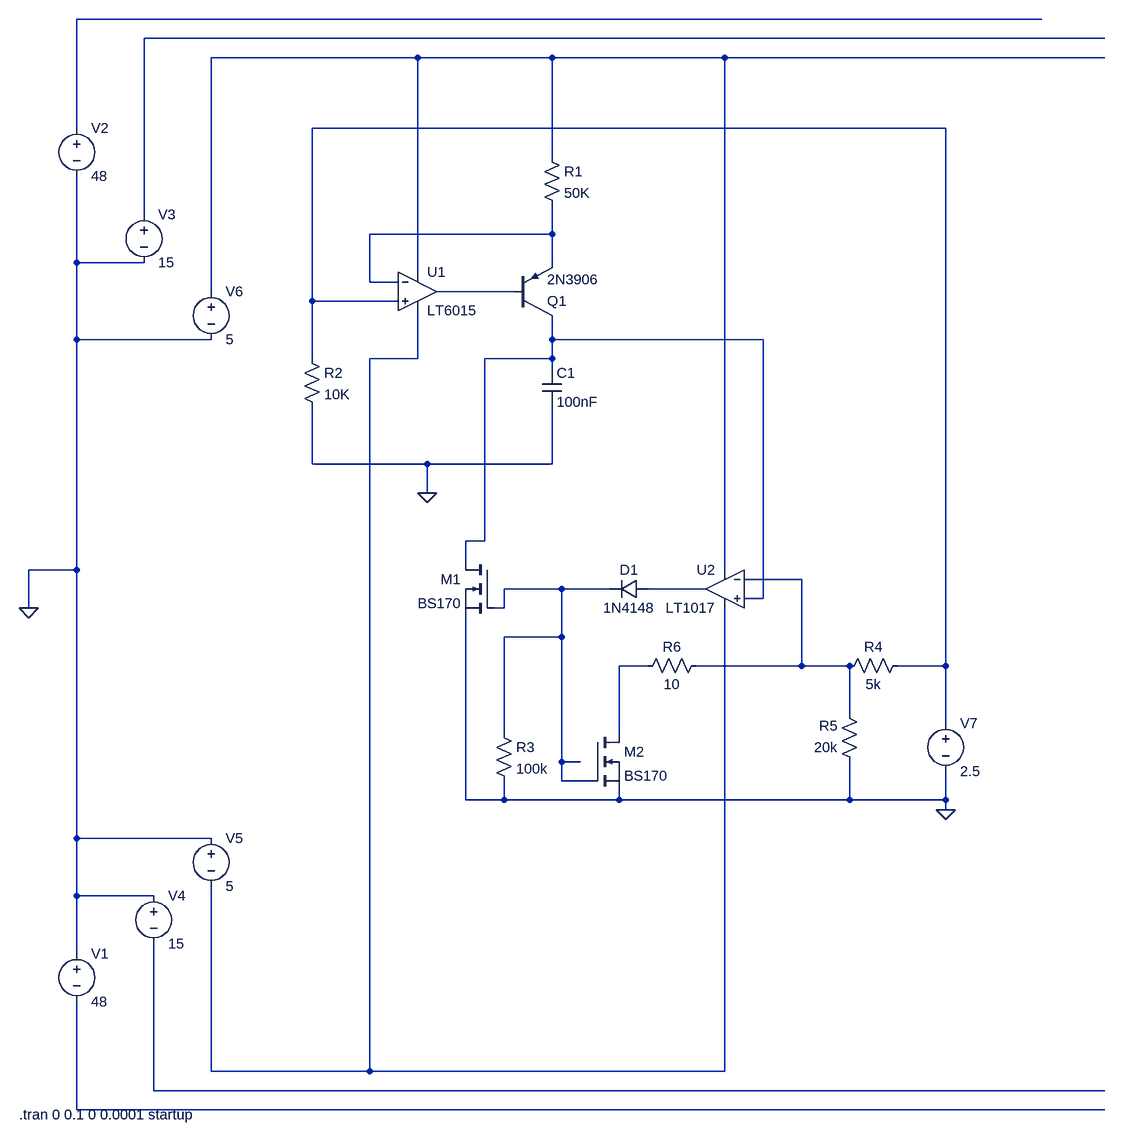
[diagram p0: schematic SWEEPGEN-2.asc]
SWEEPGEN-2.asc, the LTspice schematic file:
Version 4.1
SHEET 1 5972 680
WIRE 5328 -1472 48 -1472
WIRE 5968 -1440 160 -1440
WIRE 3376 -1408 272 -1408
WIRE 3600 -1408 3376 -1408
WIRE 3888 -1408 3600 -1408
WIRE 5968 -1408 3888 -1408
WIRE 48 -1280 48 -1472
WIRE 4256 -1280 3200 -1280
WIRE 3600 -1232 3600 -1408
WIRE 160 -1136 160 -1440
WIRE 3600 -1104 3600 -1152
WIRE 3600 -1104 3296 -1104
WIRE 48 -1056 48 -1200
WIRE 160 -1056 48 -1056
WIRE 3600 -1056 3600 -1104
WIRE 3376 -1040 3376 -1408
WIRE 3296 -1024 3296 -1104
WIRE 3344 -1024 3296 -1024
WIRE 272 -1008 272 -1408
WIRE 3536 -1008 3408 -1008
WIRE 3200 -992 3200 -1280
WIRE 3344 -992 3200 -992
WIRE 48 -928 48 -1056
WIRE 272 -928 48 -928
WIRE 3600 -928 3600 -960
WIRE 3952 -928 3600 -928
WIRE 3200 -896 3200 -992
WIRE 3376 -896 3376 -976
WIRE 3376 -896 3296 -896
WIRE 3600 -896 3600 -928
WIRE 3600 -896 3488 -896
WIRE 3600 -880 3600 -896
WIRE 3200 -720 3200 -816
WIRE 3392 -720 3200 -720
WIRE 3600 -720 3600 -816
WIRE 3600 -720 3392 -720
WIRE 3392 -672 3392 -720
WIRE 3488 -592 3488 -896
WIRE 3488 -592 3456 -592
WIRE 3456 -560 3456 -592
WIRE 48 -544 48 -928
WIRE 48 -544 -32 -544
WIRE 3888 -544 3888 -1408
WIRE 4016 -528 3920 -528
WIRE 3616 -512 3520 -512
WIRE 3696 -512 3616 -512
WIRE 3856 -512 3760 -512
WIRE 3952 -496 3952 -928
WIRE 3952 -496 3920 -496
WIRE -32 -480 -32 -544
WIRE 3520 -480 3520 -512
WIRE 3520 -480 3504 -480
WIRE 3616 -432 3616 -512
WIRE 3616 -432 3520 -432
WIRE 3760 -384 3712 -384
WIRE 4016 -384 4016 -528
WIRE 4016 -384 3840 -384
WIRE 4096 -384 4016 -384
WIRE 4256 -384 4256 -1280
WIRE 4256 -384 4176 -384
WIRE 4096 -304 4096 -384
WIRE 4256 -288 4256 -384
WIRE 3520 -272 3520 -432
WIRE 3712 -272 3712 -384
WIRE 3616 -224 3616 -432
WIRE 3648 -224 3616 -224
WIRE 3616 -192 3616 -224
WIRE 3664 -192 3616 -192
WIRE 3456 -160 3456 -464
WIRE 3520 -160 3520 -192
WIRE 3520 -160 3456 -160
WIRE 3712 -160 3712 -176
WIRE 3712 -160 3520 -160
WIRE 4096 -160 4096 -224
WIRE 4096 -160 3712 -160
WIRE 4256 -160 4256 -208
WIRE 4256 -160 4096 -160
WIRE 4256 -144 4256 -160
WIRE 48 -96 48 -544
WIRE 272 -96 48 -96
WIRE 48 0 48 -96
WIRE 176 0 48 0
WIRE 48 96 48 0
WIRE 272 304 272 -16
WIRE 3296 304 3296 -896
WIRE 3296 304 272 304
WIRE 3888 304 3888 -480
WIRE 3888 304 3296 304
WIRE 176 336 176 80
WIRE 5968 336 176 336
WIRE 48 368 48 176
WIRE 5968 368 48 368
FLAG -32 -480 0
FLAG 3392 -672 0
FLAG 4256 -144 0
SYMBOL voltage 48 80 R0
SYMATTR InstName V1
SYMATTR Value 48
SYMBOL voltage 48 -1296 R0
SYMATTR InstName V2
SYMATTR Value 48
SYMBOL voltage 160 -1152 R0
SYMATTR InstName V3
SYMATTR Value 15
SYMBOL voltage 176 -16 R0
SYMATTR InstName V4
SYMATTR Value 15
SYMBOL voltage 272 -112 R0
SYMATTR InstName V5
SYMATTR Value 5
SYMBOL voltage 272 -1024 R0
SYMATTR InstName V6
SYMATTR Value 5
SYMBOL OpAmps\\LT6015 3376 -1008 R0
SYMATTR InstName U1
SYMBOL pnp 3536 -960 M180
SYMATTR InstName Q1
SYMATTR Value 2N3906
SYMBOL cap 3584 -880 R0
SYMATTR InstName C1
SYMATTR Value 100nF
SYMBOL res 3584 -1248 R0
SYMATTR InstName R1
SYMATTR Value 50K
SYMBOL res 3184 -912 R0
SYMATTR InstName R2
SYMATTR Value 10K
SYMBOL Comparators\\LT1017 3888 -512 M0
SYMATTR InstName U2
SYMBOL voltage 4256 -304 R0
SYMATTR InstName V7
SYMATTR Value 2.5
SYMBOL res 4192 -400 R90
WINDOW 0 0 56 VBottom 2
WINDOW 3 32 56 VTop 2
SYMATTR InstName R4
SYMATTR Value 5k
SYMBOL res 4112 -208 R180
WINDOW 0 36 76 Left 2
WINDOW 3 36 40 Left 2
SYMATTR InstName R5
SYMATTR Value 20k
SYMBOL res 3744 -368 R270
WINDOW 0 32 56 VTop 2
WINDOW 3 0 56 VBottom 2
SYMATTR InstName R6
SYMATTR Value 10
SYMBOL nmos 3504 -560 M0
SYMATTR InstName M1
SYMATTR Value BS170
SYMBOL nmos 3664 -272 R0
SYMATTR InstName M2
SYMATTR Value BS170
SYMBOL diode 3760 -528 R90
WINDOW 0 0 32 VBottom 2
WINDOW 3 32 32 VTop 2
SYMATTR InstName D1
SYMATTR Value 1N4148
SYMBOL res 3504 -288 R0
SYMATTR InstName R3
SYMATTR Value 100k
TEXT -48 376 Left 2 !.tran 0 0.1 0 0.0001 startup

The netlist it stands for:
* SWEEPGEN-2.asc
V1 0 N014 48
V2 N001 0 48
V3 N002 0 15
V4 0 N013 15
V5 0 N008 5
V6 N003 0 5
X§U1 N004 N005 N003 N008 N006 LT6016  ; LT6015, pins In+ In- V+ V- OUT
Q1 N007 N006 N005 0 2N3906
C1 N007 0 100nF
R1 N003 N005 50K
R2 N004 0 10K
X§U2 N007 N009 N003 N008 N011 LT1017  ; pins In+ In- V+ V- OUT
V7 N004 0 2.5
R4 N004 N009 5k
R5 0 N009 20k
R6 N012 N009 10
M1 N007 N010 0 0 BS170
M2 N012 N010 0 0 BS170
D1 N011 N010 1N4148
R3 N010 0 100k
.model D D
.lib standard.dio
.model NPN NPN
.model PNP PNP
.lib standard.bjt
.model NMOS NMOS
.model PMOS PMOS
.lib standard.mos
.tran 0 0.1 0 0.0001 startup
.lib LTC2.lib
.backanno
.end